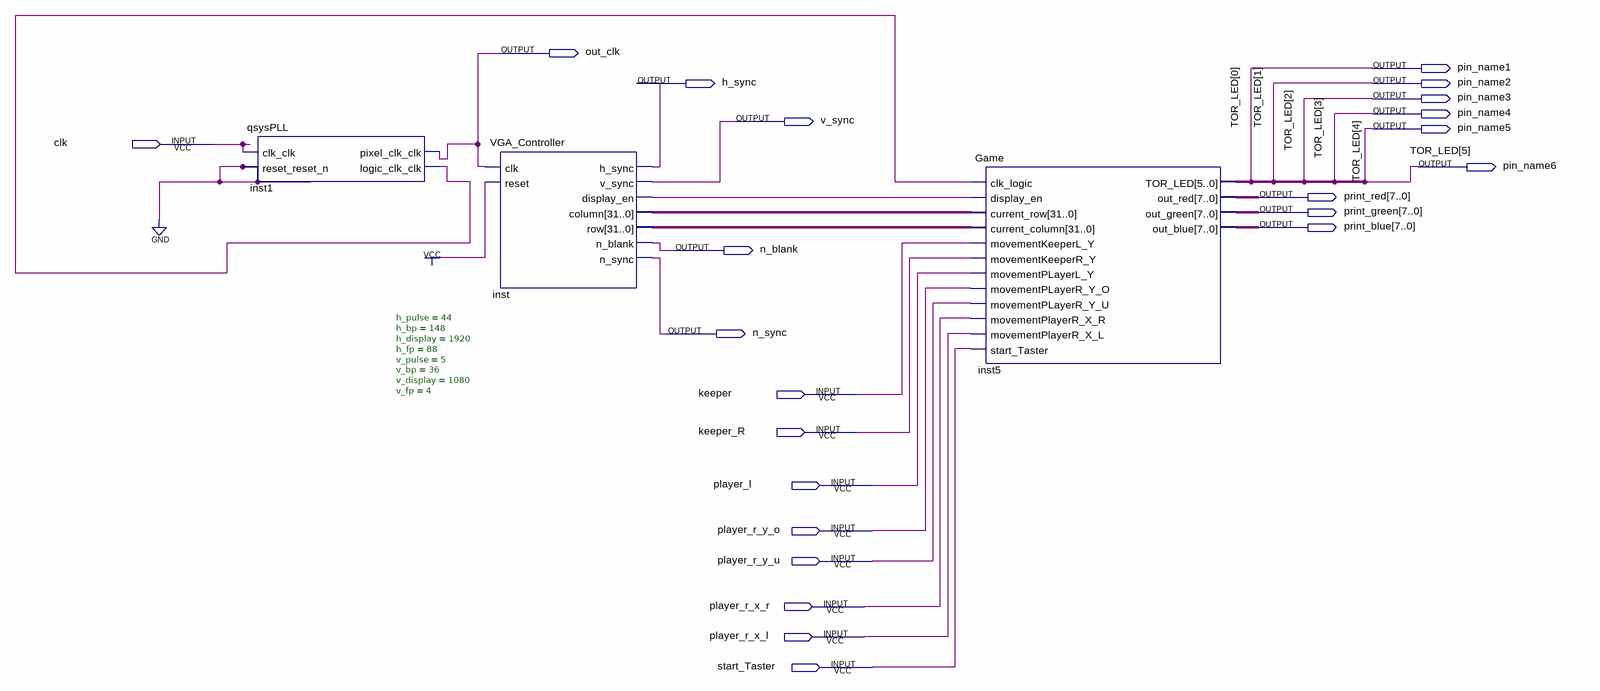
[diagram p0: schematic sheet]
// Quartus schematic VGA.bdf as structural Verilog: 3 symbols, 23 pins
module VGA (
  input  clk,
  input  keeper,
  input  keeper_R,
  input  player_l,
  input  player_r_y_o,
  input  player_r_y_u,
  input  player_r_x_r,
  input  player_r_x_l,
  input  start_Taster,
  output out_clk,
  output pin_name1,
  output h_sync,
  output pin_name2,
  output pin_name3,
  output pin_name4,
  output v_sync,
  output pin_name5,
  output pin_name6,
  output [7:0] print_red,
  output [7:0] print_green,
  output [7:0] print_blue,
  output n_blank,
  output n_sync
);

  wire inst1_logic_clk_clk, inst_display_en;
  wire [31:0] inst_column, inst_row;

  qsysPLL inst1 (.clk_clk(clk), .reset_reset_n(1'b0), .pixel_clk_clk(out_clk), .logic_clk_clk(inst1_logic_clk_clk));
  VGA_Controller #(.h_pulse(44), .h_bp(148), .h_display(1920), .h_fp(88), .v_pulse(5), .v_bp(36), .v_display(1080), .v_fp(4)) inst (
    .clk(out_clk), .reset(1'b1), .h_sync(h_sync), .v_sync(v_sync), .display_en(inst_display_en),
    .column(inst_column), .row(inst_row), .n_blank(n_blank), .n_sync(n_sync));
  Game inst5 (
    .clk_logic(inst1_logic_clk_clk), .display_en(inst_display_en), .current_row(inst_column),
    .current_column(inst_row), .movementKeeperL_Y(keeper), .movementKeeperR_Y(keeper_R),
    .movementPLayerL_Y(player_l), .movementPLayerR_Y_O(player_r_y_o), .movementPLayerR_Y_U(player_r_y_u),
    .movementPlayerR_X_R(player_r_x_r), .movementPlayerR_X_L(player_r_x_l), .start_Taster(start_Taster),
    .TOR_LED({pin_name6, pin_name5, pin_name4, pin_name3, pin_name2, pin_name1}), .out_red(print_red),
    .out_green(print_green), .out_blue(print_blue));

  // Other names for the same wires on the sheet: TOR_LED[5:0] = {pin_name6, pin_name5, pin_name4, pin_name3, pin_name2, pin_name1}
endmodule
